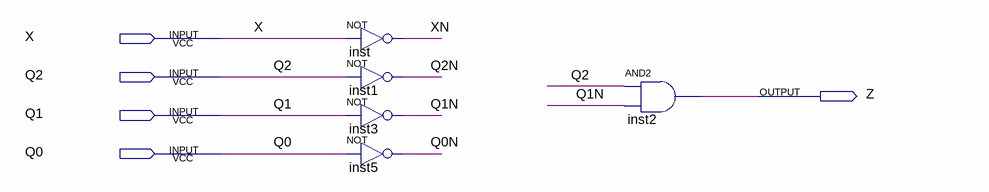
[diagram p0: schematic sheet]
// Quartus schematic Z.bdf as structural Verilog: 5 symbols, 5 pins
module Z (
  input  X,
  input  Q2,
  input  Q1,
  input  Q0,
  output Z
);

  wire Q0N, Q1N, Q2N, XN;

  not inst (XN, X);
  not inst1 (Q2N, Q2);
  not inst3 (Q1N, Q1);
  not inst5 (Q0N, Q0);
  and inst2 (Z, Q2, Q1N);
endmodule
